# Altium schematic sheet 5vBoost.SchDoc
size A
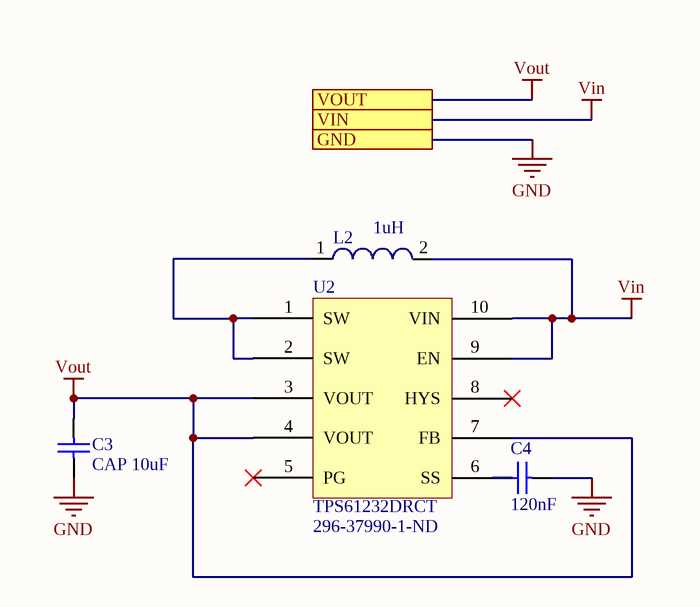
[diagram p0: 5vBoost.SchDoc]

## Parts
C3  CAP 10uF  [CAPC0805(2012)145_L]
C4  120nF  [CAPC2013X140X50ML20T25]
L2  1uH  [SMD 2510]
U2  TPS61232DRCT  Supplier Part Number 1: 296-37990-1-ND  [*SON50P300X300X100-10N]

## Ports
GND, VIN, VOUT

## Nets
GND: C3.1 C4.2 ; port GND
Vin: L2.2 U2.9(EN) U2.10(VIN) ; port VIN
Vout: C3.2 U2.3(VOUT) U2.4(VOUT) U2.7(FB) ; port VOUT
NetC4_1: C4.1 U2.6(SS)
NetL2_1: L2.1 U2.1(SW) U2.2(SW)

Not connected (* = marked no-connect by the designer): U2 5(PG)* 8(HYS)*

## Library data of the parts
C3 = CMP-1036-04927-1: CAP 10uF 16V ±10% 0805 (2012 Metric) Thickness 1.45mm SMD; Case-EIA: 0805; Tolerance: Â±10%; Case-Metric: 2012; Rated Voltage: 16 V; Technology: SMT; Value: 10uF; Max Thickness: 1.45 mm
C4 = CMP-2007-04709-1: Manufacturer: AVX Interconnect / Elco; Part Number: 08055C124KAT2A
L2 = CMP-1411-00009-1: Power Multilayer Inductor WE-MAPI, L=1.0µH; Manufacturer: Wuerth Elektronik; PartNumber: 74438323010; Inductance: 1.0ÂµH; ComponentLink2URL: http://katalog.we-online.de/kataloge/eisos/media/pdf/74438323010.pdf; ComponentLink1URL: http://www.we-online.com; PackageReference: SMD 2510; ComponentLink2Description: Datasheet; ComponentLink1Description: Manufacturer URL
U2 = TPS61232DRCT: Manufacturer: Texas Instruments; Min Input Voltage: 2.3V; Max Input Voltage: 5.5V; Output Current: 2.1A; Number of Outputs: 1; Output Voltage: 5V; Efficiency: 96%; Switching Frequency: 2MHz; Quiescent Current: 35uA; Topology: Boost; Output Type: Fixed; Synchronous Rectifier: Yes; Output Configuration: Positive; Supplier 1: Digi-Key; Manufacturer Part Number: TPS61232DRCT; RoHS: Yes; Stock 1: 5502; Pricing 1: 1 = 2.92000, 10 = 2.62600, 100 = 2.11050 (USD); Mount: Surface Mount; Number of Pins: 10; Weight: 0.000921oz; Contact Plating: Gold; Min Operating Temperature: -40°C; Max Operating Temperature: 85°C; Max Output Current: 2.1A; Operating Supply Voltage: 5.5V; Nominal Output Voltage: 5V; Packaging: Tape and Reel; Min Output Voltage: 5V; Operating Supply Current: 35uA; Package Quantity: 250; Min Supply Voltage: 2.3V; Lead Free: Lead Free; REACH SVHC: No SVHC; ComponentLink1URL: http://www.farnell.com/datasheets/1902710.pdf?src-supplier=Element14; ComponentLink1Description: http://www.farnell.com/datasheets/1902710.pdf?src-supplier=Element14